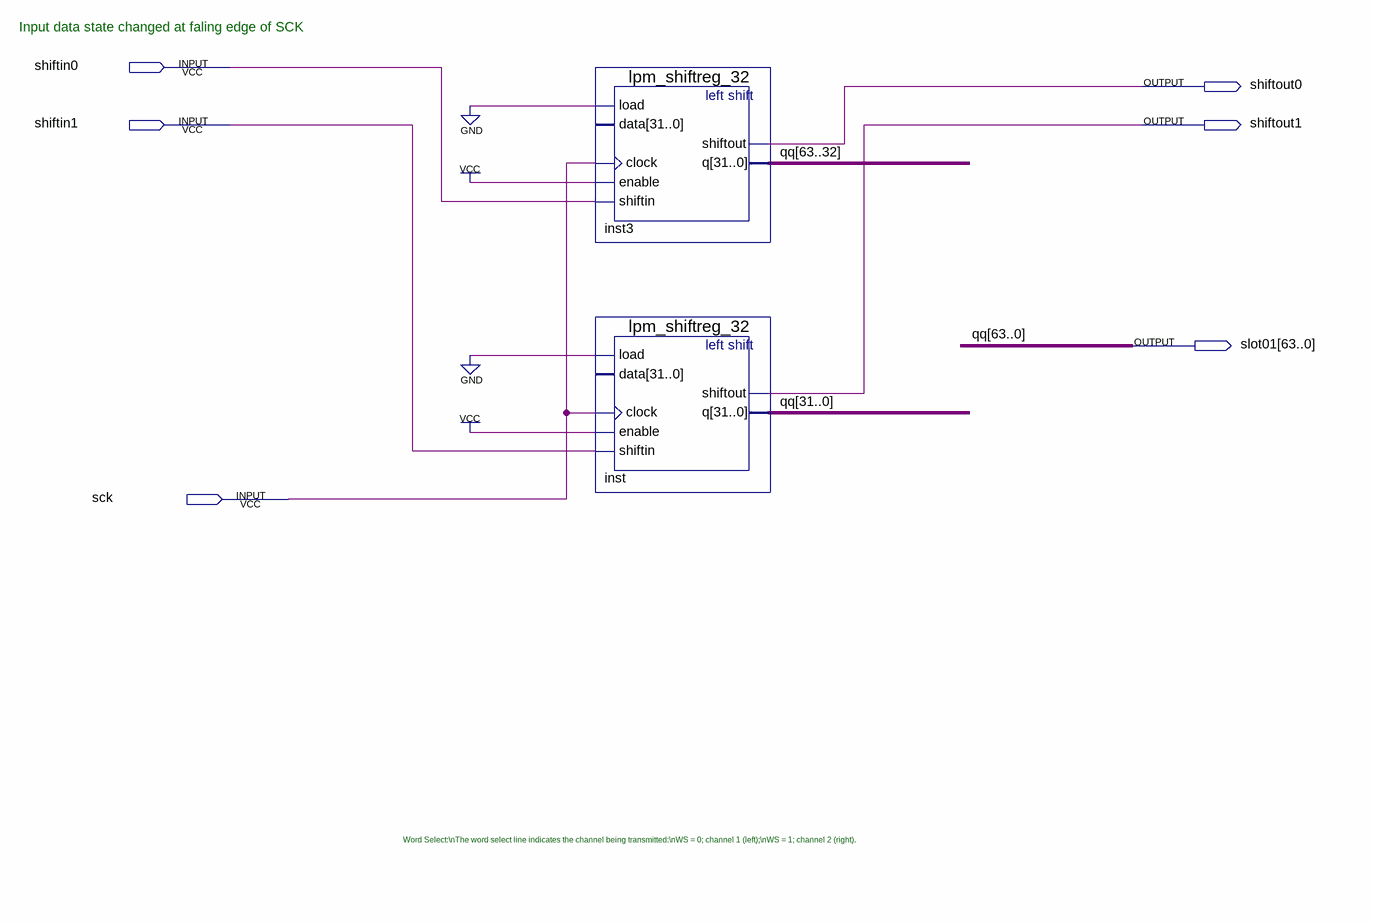
[diagram p0: schematic sheet]
// Quartus schematic i2s_rx_slave.bdf as structural Verilog: 2 symbols, 6 pins
module i2s_rx_slave (
  input  shiftin0,
  input  shiftin1,
  input  sck,
  output shiftout0,
  output shiftout1,
  output [63:0] slot01
);

  lpm_shiftreg_32 inst3 (
    .clock(sck), .enable(1'b1), .load(1'b0), .shiftin(shiftin0), .q(slot01[63:32]), .shiftout(shiftout0));  // open: data
  lpm_shiftreg_32 inst (
    .clock(sck), .enable(1'b1), .load(1'b0), .shiftin(shiftin1), .q(slot01[31:0]), .shiftout(shiftout1));  // open: data

  // Other names for the same wires on the sheet: qq[63:0] = slot01

  // Notes on the sheet:
  //   Input data state changed at faling edge of SCK
  //   Word Select:\nThe word select line indicates the channel being transmitted:\nWS = 0; channel 1 (left);\nWS = 1; channel 2 (right).
endmodule
